# EAGLE design CSS811_CO2_TVOC_Breakout (EAGLE 7.7.0)
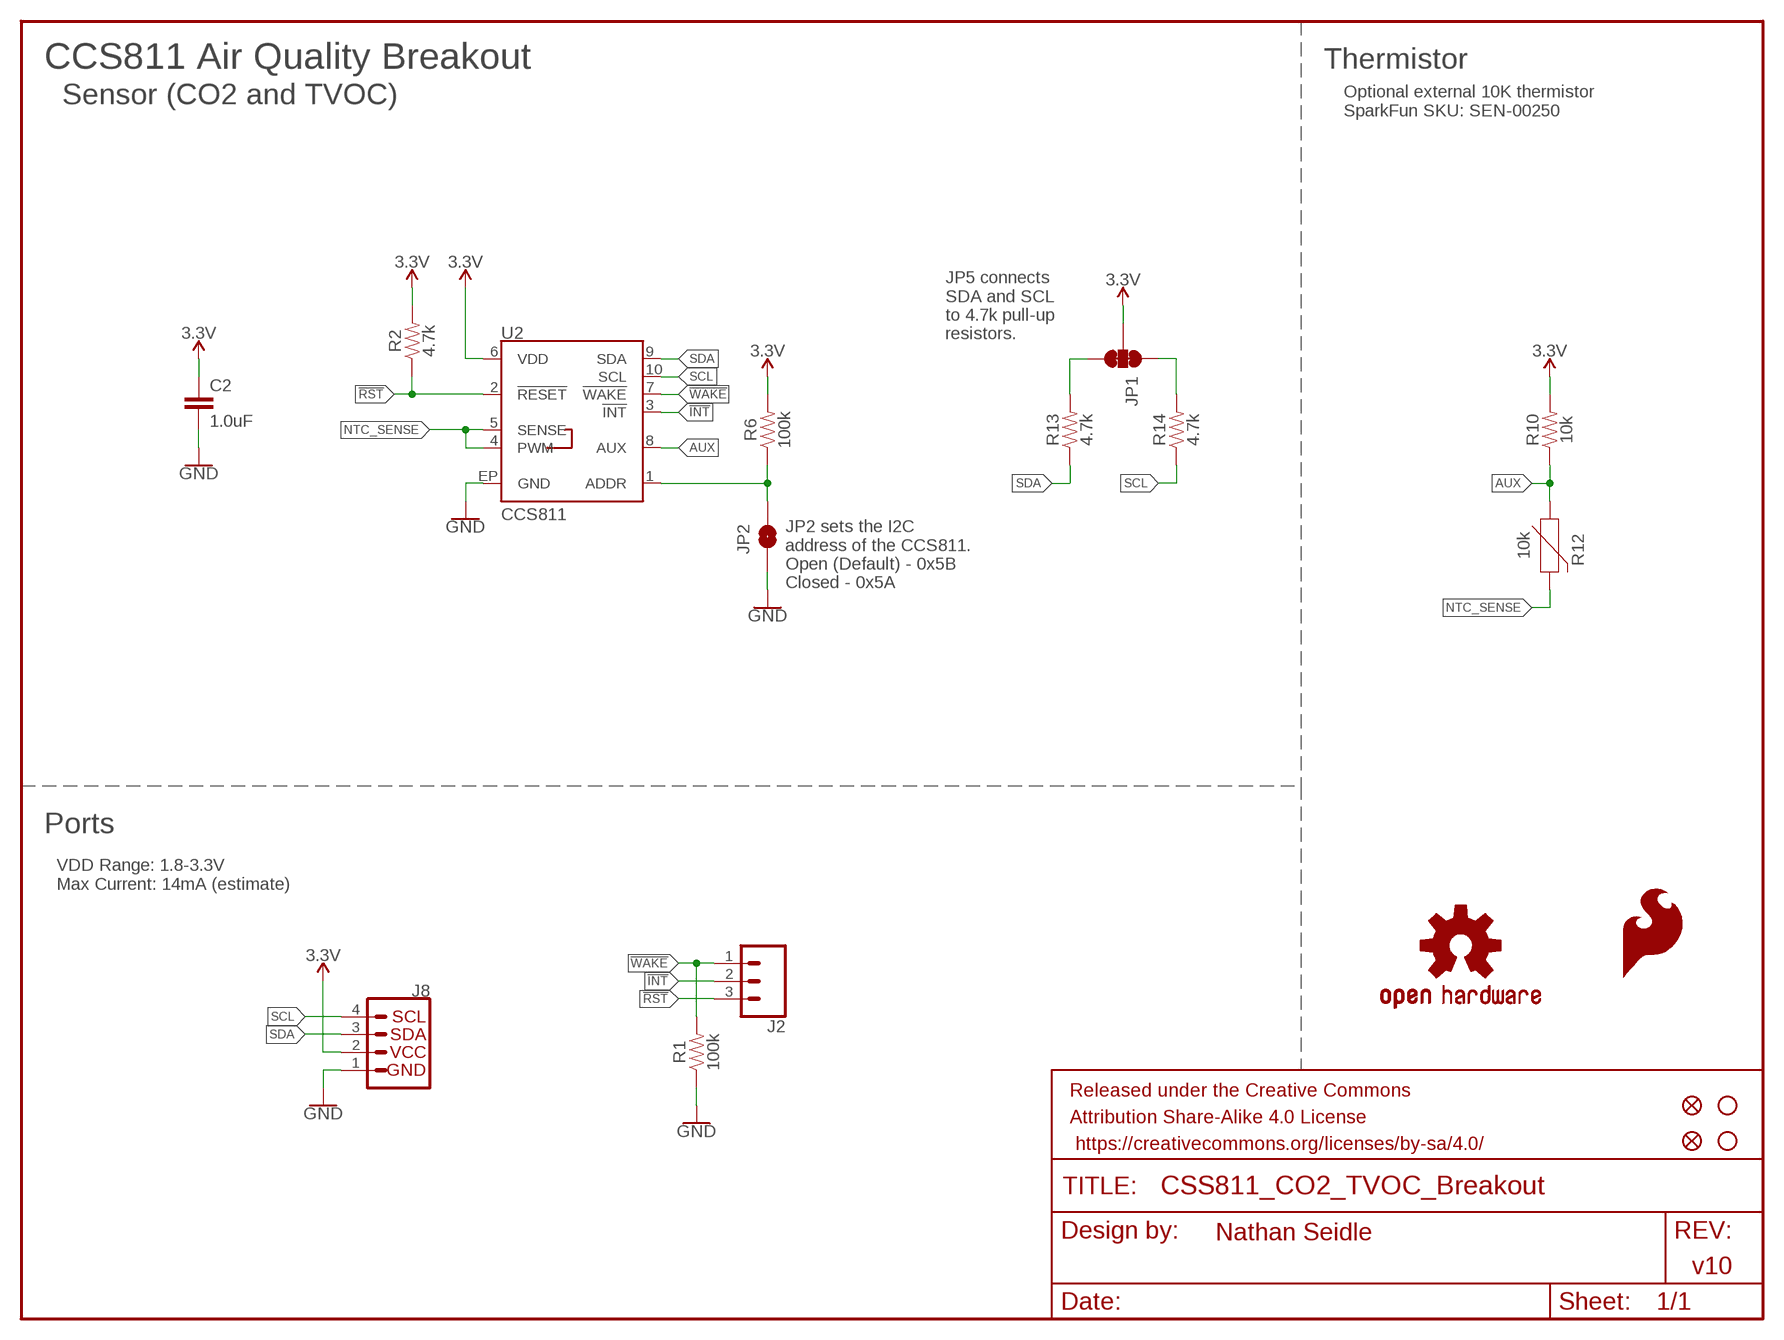
[diagram p0: schematic, sheet 1]

## Parts
C2  1.0uF  1.0UF-0603-16V-10%  [0603]
FD1  FIDUCIAL1X2  [FIDUCIAL-1X2]
FD2  FIDUCIAL1X2  [FIDUCIAL-1X2]
FRAME1  FRAME-LETTER  [CREATIVE_COMMONS]
H2  STAND-OFF  [STAND-OFF]
H4  STAND-OFF  [STAND-OFF]
J2  CONN_031X03_NO_SILK  [1X03_NO_SILK]
J8  I2C_STANDARD_NO_SILK  [1X04_NO_SILK]
JP1  JUMPER-SMT_3_2-NC_TRACE_SILK  [SMT-JUMPER_3_2-NC_TRACE_SILK]
JP2  JUMPER-SMT_2_NO_SILK  [SMT-JUMPER_2_NO_SILK]
LOGO1  SFE_LOGO_FLAME.2_INCH  [SFE_LOGO_FLAME_.2]
LOGO4  OSHW-LOGOS  [OSHW-LOGO-S]
R1  100k  100KOHM-0603-1/10W-1%  [0603]
R2  4.7k  4.7KOHM-0603-1/10W-1%  [0603]
R6  100k  100KOHM-0603-1/10W-1%  [0603]
R10  10k  10KOHM-0603-1/10W-1%  [0603]
R12  10k  NTC-THERMISTOR-AXIAL-0.1  [AXIAL-0.1]
R13  4.7k  4.7KOHM-0603-1/10W-1%  [0603]
R14  4.7k  4.7KOHM-0603-1/10W-1%  [0603]
U2  CCS811  [LGA10]

## Nets
3.3V: C2.1 J8.2 JP1.2 R2.2 R6.2 R10.2 U2.6(VDD)
!INT: J2.2 U2.3(!INT!)
!RST: J2.3 R2.1 U2.2(!RESET!)
!WAKE: J2.1 R1.2 U2.7(!WAKE!)
AUX: R10.1 R12.P$1 U2.8(AUX)
CCS811_ADDR: JP2.2 R6.1 U2.1(ADDR)
GND: C2.2 J8.1 JP2.1 R1.1 U2.EP(GND)
N$4: JP1.3 R13.2
N$5: JP1.1 R14.2
NTC_SENSE: R12.P$2 U2.4(PWM) U2.5(SENSE)
SCL: J8.4 R14.1 U2.10(SCL)
SDA: J8.3 R13.1 U2.9(SDA)

## Notes on the sheet
- CCS811 Air Quality Breakout | Thermistor
- Optional external 10K thermistor
  SparkFun SKU: SEN-00250
- Sensor (CO2 and TVOC)
- JP5 connects 
  SDA and SCL 
  to 4.7k pull-up 
  resistors.
- JP2 sets the I2C 
  address of the CCS811.
  Open (Default) - 0x5B
  Closed - 0x5A
- Ports
- VDD Range: 1.8-3.3V
  Max Current: 14mA (estimate)
- Nathan Seidle
- v10

## Library data of the parts
C2 = SparkFun-Capacitors:1.0UF: 1µF ceramic capacitors A capacitor is a passive two-terminal electrical component used to store electrical energy temporarily in an electric field.; PROD_ID: CAP-00868
FD1 FD2 = SparkFun-Aesthetics:FIDUCIAL: Fiducial Alignment Points Point-of-reference for pick-and-place machines and other optical instruments.
FRAME1 = SparkFun-Aesthetics:FRAME-LETTER: Schematic Frame - Letter Standard 8.5x11 US Letter frame
H2 H4 = SparkFun-Hardware:STAND-OFF: Stand Off Drill holes for mechanically mounting via screws, standoffs, etc. Note: Use the keepout ring to avoid running the screw head into surrounding components. Variant Overviews STAND-OFF - Mechanical footprint for a #4 phillips button head screw. STAND-OFF-TIGHT - Mechanical footprint for a #4 phillips button head screw, Example SparkFun Products Screw - Phillips Head (1/4", 4-40, 10 pack) <https://www.sparkfun.com/products/10453> (PRT-10453) Screw - Phillips Head (1/2", 4-40, 10 pack) <https://www.sparkfun.com/products/10452> (PRT-10452) Screw - Phillips Head (3/4", 4-40, 10 pack) <https://www.sparkfun.com/products/10451> (PRT-10451) Screw - Phillips Head (1", 4-40, 10 pack) <https://www.sparkfun.com/products/10450> (PRT-10450)
J2 = SparkFun-Connectors:CONN_03: Multi connection point. Often used as Generic Header-pin footprint for 0.1 inch spaced/style header connections On any of the 0.1 inch spaced packages, you can populate with these: Break Away Headers - Straight <https://www.sparkfun.com/products/116> (PRT-00116) Break Away Male Headers - Right Angle <https://www.sparkfun.com/products/553> (PRT-00553) Female Headers <https://www.sparkfun.com/products/115> (PRT-00115) Break Away Headers - Machine Pin <https://www.sparkfun.com/products/117> (PRT-00117) Break Away Female Headers - Swiss Machine Pin <https://www.sparkfun.com/products/743> (PRT-00743) Stackable Header - 3 Pin (Female, 0.1") <https://www.sparkfun.com/products/13875> (PRT-13875) For SCREWTERMINALS and SPRING TERMINALS visit here: Screw Terimnals on SparkFun.com <https://www.sparkfun.com/search/results?term=Screw+Terminals> (5mm/3.5mm/2.54mm spacing) This device is also useful as a general connection point to wire up your design to another part of your project. Our various solder wires solder well into these plated through hole pads. Hook-Up Wire - Assortment (Stranded, 22 AWG) <https://www.sparkfun.com/products/11375> (PRT-11375) Hook-Up Wire - Assortment (Solid Core, 22 AWG) <https://www.sparkfun.com/products/11367> (PRT-11367) View the entire wire category on our website here <https://www.sparkfun.com/categories/141> Special notes: Molex polarized connector foot print use with SKU : PRT-08232 with associated crimp pins and housings.
J8 = SparkFun-Connectors:I2C_STANDARD: SparkFun I2C Standard Pinout Header SparkFun has standardized on a pinout for all I2C based sensor breakouts. This pinout allows I2C boards to be plugged directly into the headers on Arduino Uno compatible boards, and to be daisy chained easily. Example SparkFun Products: SparkFun Atmospheric Sensor Breakout - BME280 <https://www.sparkfun.com/products/13676> SparkFun Altitude/Pressure Sensor Breakout - MPL3115A2 <https://www.sparkfun.com/products/11084> SparkFun TOF Range Finder Sensor - VL6180 <https://www.sparkfun.com/products/12785>
JP1 = SparkFun-Jumpers:JUMPER-SMT_3_2-NC_TRACE: Normally closed trace jumper (2 of 2 connections) This jumper has a trace between all three pads so they are normally closed (NC). Use a razor knife to open the connection(s). For best results follow the IPC guidelines for cutting traces: Cutout at least 0.063 mm (0.005 in). Remove all loose material to clean up the cut area. Seal the cut with an approved epoxy. Reapply solder to reclose the connection(s).
JP2 = SparkFun-Jumpers:JUMPER-SMT_2_NO: Normally open jumper This jumper has two pads in close proximity to each other. Apply solder to close the connection. Round pads are easier to solder for beginners, but are a lot larger. SparkFun Product that uses the round pads: SparkFun EL Sequencer <https://www.sparkfun.com/products/12781>
LOGO1 = SparkFun-Aesthetics:SFE_LOGO_FLAME: SparkFun Flame Logo This is the SparkFun flame logo. The logo on the schematic will always be the same size; the package variant is the height of the flame. Default layer for the logo on the board is tSilk.
LOGO4 = SparkFun-Aesthetics:OSHW-LOGO: Open-Source Hardware (OSHW) Logo This logo indicates the piece of hardware it is found on incorporates a OSHW license and/or adheres to the definition of open source hardware found here: http://freedomdefined.org/OSHW
R1 R6 = SparkFun-Resistors:100KOHM: 100kΩ resistor A resistor is a passive two-terminal electrical component that implements electrical resistance as a circuit element. Resistors act to reduce current flow, and, at the same time, act to lower voltage levels within circuits. - Wikipedia; PROD_ID: RES-07828
R2 R13 R14 = SparkFun-Resistors:4.7KOHM: 4.7kΩ resistor A resistor is a passive two-terminal electrical component that implements electrical resistance as a circuit element. Resistors act to reduce current flow, and, at the same time, act to lower voltage levels within circuits. - Wikipedia; PROD_ID: RES-07857
R10 = SparkFun-Resistors:10KOHM: 10kΩ resistor A resistor is a passive two-terminal electrical component that implements electrical resistance as a circuit element. Resistors act to reduce current flow, and, at the same time, act to lower voltage levels within circuits. - Wikipedia; PROD_ID: RES-00824
R12 = CCS811_Breakout_Temp:NTC-THERMISTOR: NTC Thermistor An NTC thermistor's resistance decreases as temperature rises. Applications: Resistance Thermometer - temperature monitoring Inrush current limiter Heat source; PROD_ID: N/A; SF_ID: SEN-00250
U2 = CCS811_Breakout_Temp:CCS811: AMS CCS811 – I2C Digital Gas Sensor Ultra-Low Power Digital Gas Sensor for Monitoring Indoor Air Quality AMS Product Page <http://ams.com/eng/Products/Environmental-Sensors/Gas-Sensors/CCS811> SparkFun Products:; PROD_ID: IC-13607

## Board
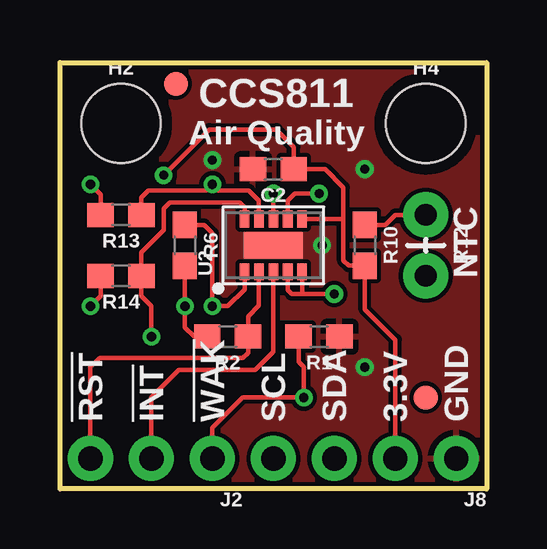
[diagram p1: board, top side]
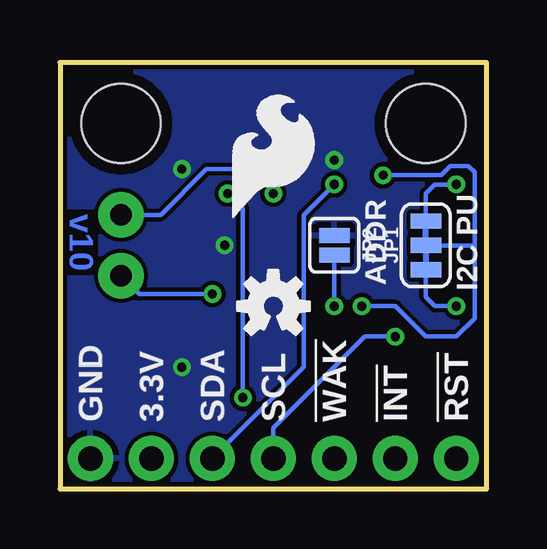
[diagram p2: board, bottom side, seen from below]

Size 17.78 x 17.78 mm. Coordinates in mm from the lower left corner, seen from the top.
Outline: 0,0 0,17.78 17.78,17.78 17.78,0 0,0
Copper layers (1*16): Top 0.035mm / dielectric 1.5mm / Bottom 0.035mm
Design rules "SparkFun-2-layer-TIGHT": minimum track width 7mil, minimum drill 15mil, track to track 7mil, track to pad 7mil, pad to pad 7mil, via to via 7mil, smd to smd 7mil, copper to edge 7mil, drill to drill 7mil, minimum pad ring 7mil, minimum via ring 7mil, stop-mask expansion 4mil, vias tented up to drill 25mil, thermal gap 10mil

### Footprints (pad centres in the part's own frame; a part is rotated, then mirrored left to right if it is on the bottom)
0603 = smd 1.1 x 1: 1 -0.85,0; 2 0.85,0
FIDUCIAL-1X2 = smd 1 x 1: 1 0,0
STAND-OFF = hole 3.302: 0,0
1X03_NO_SILK = drill 1.016 pad 1.88: 1 0,0; 2 2.54,0; 3 5.08,0
1X04_NO_SILK = drill 1.016 pad 1.88: 1 0,0; 2 2.54,0; 3 5.08,0; 4 7.62,0
SMT-JUMPER_3_2-NC_TRACE_SILK = smd 0.635 x 1.27: 1 -1.016,0; 2 0,0; 3 1.016,0
SMT-JUMPER_2_NO_SILK = smd 0.635 x 1.27: 1 -0.406,0; 2 0.406,0
AXIAL-0.1 = drill 0.9 pad 1.88: P$1 -1.27,0; P$2 1.27,0
LGA10 = smd 0.7 x 0.4: 1 -1.1,1.2; 2 -1.1,0.6; 3 -1.1,0; 4 -1.1,-0.6; 5 -1.1,-1.2; 6 1.1,-1.2; 7 1.1,-0.6; 8 1.1,0; 9 1.1,0.6; 10 1.1,1.2 | smd 1.1 x 2.45: EP 0,0

### Placement (x,y rotation side)
C2  8.89,13.34 180 top
FD1  4.83,16.89 0 top
FD2  15.24,3.81 0 top
FRAME1  -13.97,-21.59 0 top  (outside the outline)
H2  2.54,15.24 0 top
H4  15.24,15.24 0 top
J2  6.35,1.27 180 top
J8  16.51,1.27 180 top
JP1  2.54,10.16 90 bottom
JP2  6.35,10.16 270 bottom
LOGO1  10.92,11.05 0 bottom
LOGO4  8.89,7.62 0 bottom
R1  10.79,6.35 180 top
R2  6.99,6.35 180 top
R6  5.21,10.16 270 top
R10  12.7,10.16 270 top
R12  15.24,10.16 270 top
R13  2.54,11.43 180 top
R14  2.54,8.89 180 top
U2  8.89,10.16 90 top

### Tracks (layer width: path | path; a pad name or v marks a point on that pad's centre or on a via)
3.3V  (via drill 0.38)
  Top 0.178: J8.2 13.97,6.22 12.7,7.49 R10.2 12.03,9.31 11.81,9.53 11.81,11.3 | U2.6 11.77,11.26 11.81,11.3 | v4.32,13.08 6.22,14.99 9.02,14.99 9.74,14.26 C2.1 11.05,13.34 11.81,12.57 11.81,11.3 | R6.2 v5.21,7.62 5.21,6.73 5.59,6.35 R2.2
  Bottom 0.178: v4.32,13.08 1.91,13.08 1.52,13.46 0.76,13.46 0.51,13.21 0.51,10.16 | 0.51,10.16 0.51,7.11 1.27,6.35 2.54,6.35 3.81,7.62 v5.21,7.62 | JP1.2 0.51,10.16
!INT
  Top 0.178: U2.3 8.89,5.71 8.13,4.95 4.95,4.95 3.81,3.81 J2.2
!RST
  Top 0.178: U2.2 8.29,7.66 7.83,7.2 R2.1 7.83,5.68 7.62,5.46 1.65,5.46 1.27,5.08 J2.3
!WAKE  (via drill 0.38)
  Top 0.178: U2.7 9.49,12.03 9.78,12.32 v10.79,12.32 | J2.1 6.35,2.54 7.62,3.81 v10.16,3.81 10.16,5.08 9.95,5.29 R1.2
  Bottom 0.178: v10.16,3.81 10.16,11.68 v10.79,12.32
AUX  (via drill 0.38)
  Top 0.178: R10.1 13.55,11.01 13.97,11.43 R12.P$1 | U2.8 v8.89,12.32
  Bottom 0.178: v8.89,12.32 8.89,12.95 9.27,13.34 11.68,13.34 13.59,11.43 R12.P$1
CCS811_ADDR  (via drill 0.38)
  Top 0.178: R6.1 6.01,11.01 6.35,10.67 v6.35,7.62 6.99,7.62 7.69,8.32 U2.1
  Bottom 0.178: JP2.2 v6.35,7.62
GND  (via drill 0.38)
  other vias: 6.35,13.72 10.92,10.16 12.7,13.34 12.7,5.08
  pour Top (isolate 0.178): 0,0 17.78,0 17.78,17.78 0,17.78
  pour Bottom (isolate 0.178): 0,17.78 17.78,17.78 17.78,0 0,0
N$4  (via drill 0.38)
  Top 0.178: R13.2 1.69,12.28 v1.27,12.7
  Bottom 0.178: v1.27,12.7 2.16,12.7 2.54,12.32 JP1.3
N$5  (via drill 0.38)
  Top 0.178: R14.2 1.69,8.04 v1.27,7.62
  Bottom 0.178: v1.27,7.62 2.16,7.62 2.54,8 JP1.1
NTC_SENSE  (via drill 0.38)
  Top 0.178: 10.16,8.13 9.65,8.13 9.49,8.29 U2.4 | 10.16,8.13 v11.43,8.13 | U2.5 10.09,8.2 10.16,8.13
  Bottom 0.178: v11.43,8.13 14.48,8.13 R12.P$2
SCL  (via drill 0.38)
  Top 0.178: v3.81,6.35 3.81,7.62 3.39,8.04 R14.1 3.39,9.87 4.32,10.79 4.32,11.68 4.57,11.94 7.49,11.94 7.69,11.74 U2.10
  Bottom 0.178: v3.81,6.35 5.08,6.35 8.89,2.54 J8.4
SDA  (via drill 0.38)
  Top 0.178: R13.1 3.39,12.15 3.68,12.45 6.1,12.45 v6.35,12.7 6.6,12.45 7.87,12.45 8.29,12.03 U2.9
  Bottom 0.178: J8.3 7.62,5.08 7.62,11.43 v6.35,12.7

### Text on the board
Bottom: v10
tPlace: CCS811 | Air Quality | NTC | !RST | !INT | !WAK | SCL | SDA | 3.3V | GND
bPlace: I2C PU | ADDR | !RST | !INT | !WAK | SCL | SDA | 3.3V | GND
Measures: All measurements in inches
tDocu: Nathan Seidle